# EAGLE schematic hub_small (EAGLE 9.6.2)
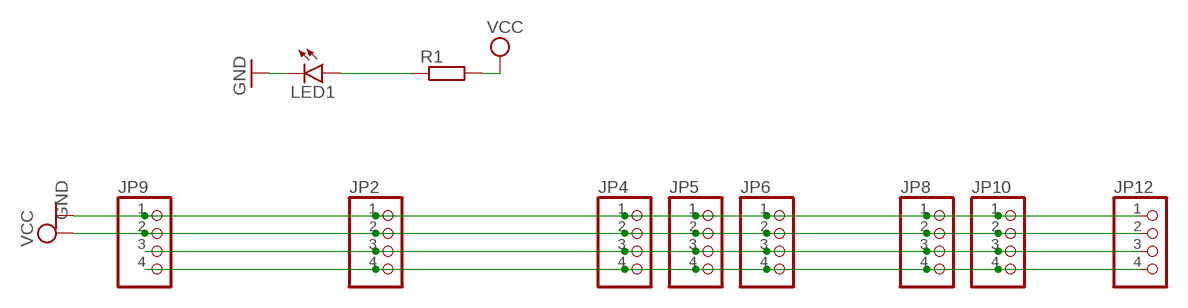
[diagram p0: schematic, sheet 1]

## Parts
JP2  PINHD-1X04_2.54-SMD  [1X04SMD]
JP4  PINHD-1X04_2.54-SMD  [1X04SMD]
JP5  PINHD-1X04_2.54-SMD  [1X04SMD]
JP6  PINHD-1X04_2.54-SMD  [1X04SMD]
JP8  PINHD-1X04_2.54-SMD  [1X04SMD]
JP9  PINHD-1X04_2.54-SMD  [1X04SMD]
JP10  PINHD-1X04_2.54-SMD  [1X04SMD]
JP12  PINHD-1X04_2.54-SMD  [1X04SMD]
LED1  LEDCHIPLED_1206  [CHIPLED_1206]
R1  R-EU_R1206  [R1206]

## Nets
GND: JP2.1 JP4.1 JP5.1 JP6.1 JP8.1 JP9.1 JP10.1 JP12.1 LED1.C
N$2: JP2.4 JP4.4 JP5.4 JP6.4 JP8.4 JP9.4 JP10.4 JP12.4
N$3: LED1.A R1.1
N$5: JP2.3 JP4.3 JP5.3 JP6.3 JP8.3 JP9.3 JP10.3 JP12.3
VCC: JP2.2 JP4.2 JP5.2 JP6.2 JP8.2 JP9.2 JP10.2 JP12.2 R1.2

## Library data of the parts
JP2 JP4-JP6 JP8-JP10 JP12 = pinhead-2:PINHD-1X04: PIN HEADER
LED1 = led:LED: LED OSRAM: - CHIPLED LG R971, LG N971, LY N971, LG Q971, LY Q971, LO R971, LY R971 LH N974, LH R974 LS Q976, LO Q976, LY Q976 LO Q996 - Hyper CHIPLED LW Q18S LB Q993, LB Q99A, LB R99A - SideLED LS A670, LO A670, LY A670, LG A670, LP A670 LB A673, LV A673, LT A673, LW A673 LH A674 LY A675 LS A676, LA A676, LO A676, LY A676, LW A676 LS A679, LY A679, LG A679 - Hyper Micro SIDELED® LS Y876, LA Y876, LO Y876, LY Y876 LT Y87S - SmartLED LW L88C, LW L88S LB L89C, LB L89S, LG L890 LS L89K, LO L89K, LY L89K LS L896, LA L896, LO L896, LY L896 - TOPLED LS T670, LO T670, LY T670, LG T670, LP T670 LSG T670, LSP T670, LSY T670, LOP T670, LYG T670 LG T671, LOG T671, LSG T671 LB T673, LV T673, LT T673, LW T673 LH T674 LS T676, LA T676, LO T676, LY T676, LB T676, LH T676, LSB T676, LW T676 LB T67C, LV T67C, LT T67C, LS T67K, LO T67K, LY T67K, LW E67C LS E67B, LA E67B, LO E67B, LY E67B, LB E67C, LV E67C, LT E67C LW T67C LS T679, LY T679, LG T679 LS T770, LO T770, LY T770, LG T770, LP T770 LB T773, LV T773, LT T773, LW T773 LH T774 LS E675, LA E675, LY E675, LS T675 LS T776, LA T776, LO T776, LY T776, LB T776 LHGB T686 LT T68C, LB T68C - Hyper Mini TOPLED® LB M676 - Mini TOPLED Santana® LG M470 LS M47K, LO M47K, LY M47K Source: http://www.osram.convergy.de LUXEON: - LUMILED® LXK2-PW12-R00, LXK2-PW12-S00, LXK2-PW14-U00, LXK2-PW14-V00 LXK2-PM12-R00, LXK2-PM12-S00, LXK2-PM14-U00 LXK2-PE12-Q00, LXK2-PE12-R00, LXK2-PE12-S00, LXK2-PE14-T00, LXK2-PE14-U00 LXK2-PB12-K00, LXK2-PB12-L00, LXK2-PB12-M00, LXK2-PB14-N00, LXK2-PB14-P00, LXK2-PB14-Q00 LXK2-PR12-L00, LXK2-PR12-M00, LXK2-PR14-Q00, LXK2-PR14-R00 LXK2-PD12-Q00, LXK2-PD12-R00, LXK2-PD12-S00 LXK2-PH12-R00, LXK2-PH12-S00 LXK2-PL12-P00, LXK2-PL12-Q00, LXK2-PL12-R00 Source: www.luxeon.com KINGBRIGHT: KA-3528ASYC Source: www.kingbright.com
R1 = rcl:R-EU_: RESISTOR, European symbol; SPICEPREFIX: R